# Altium project SDP_V2.0.PrjPcb
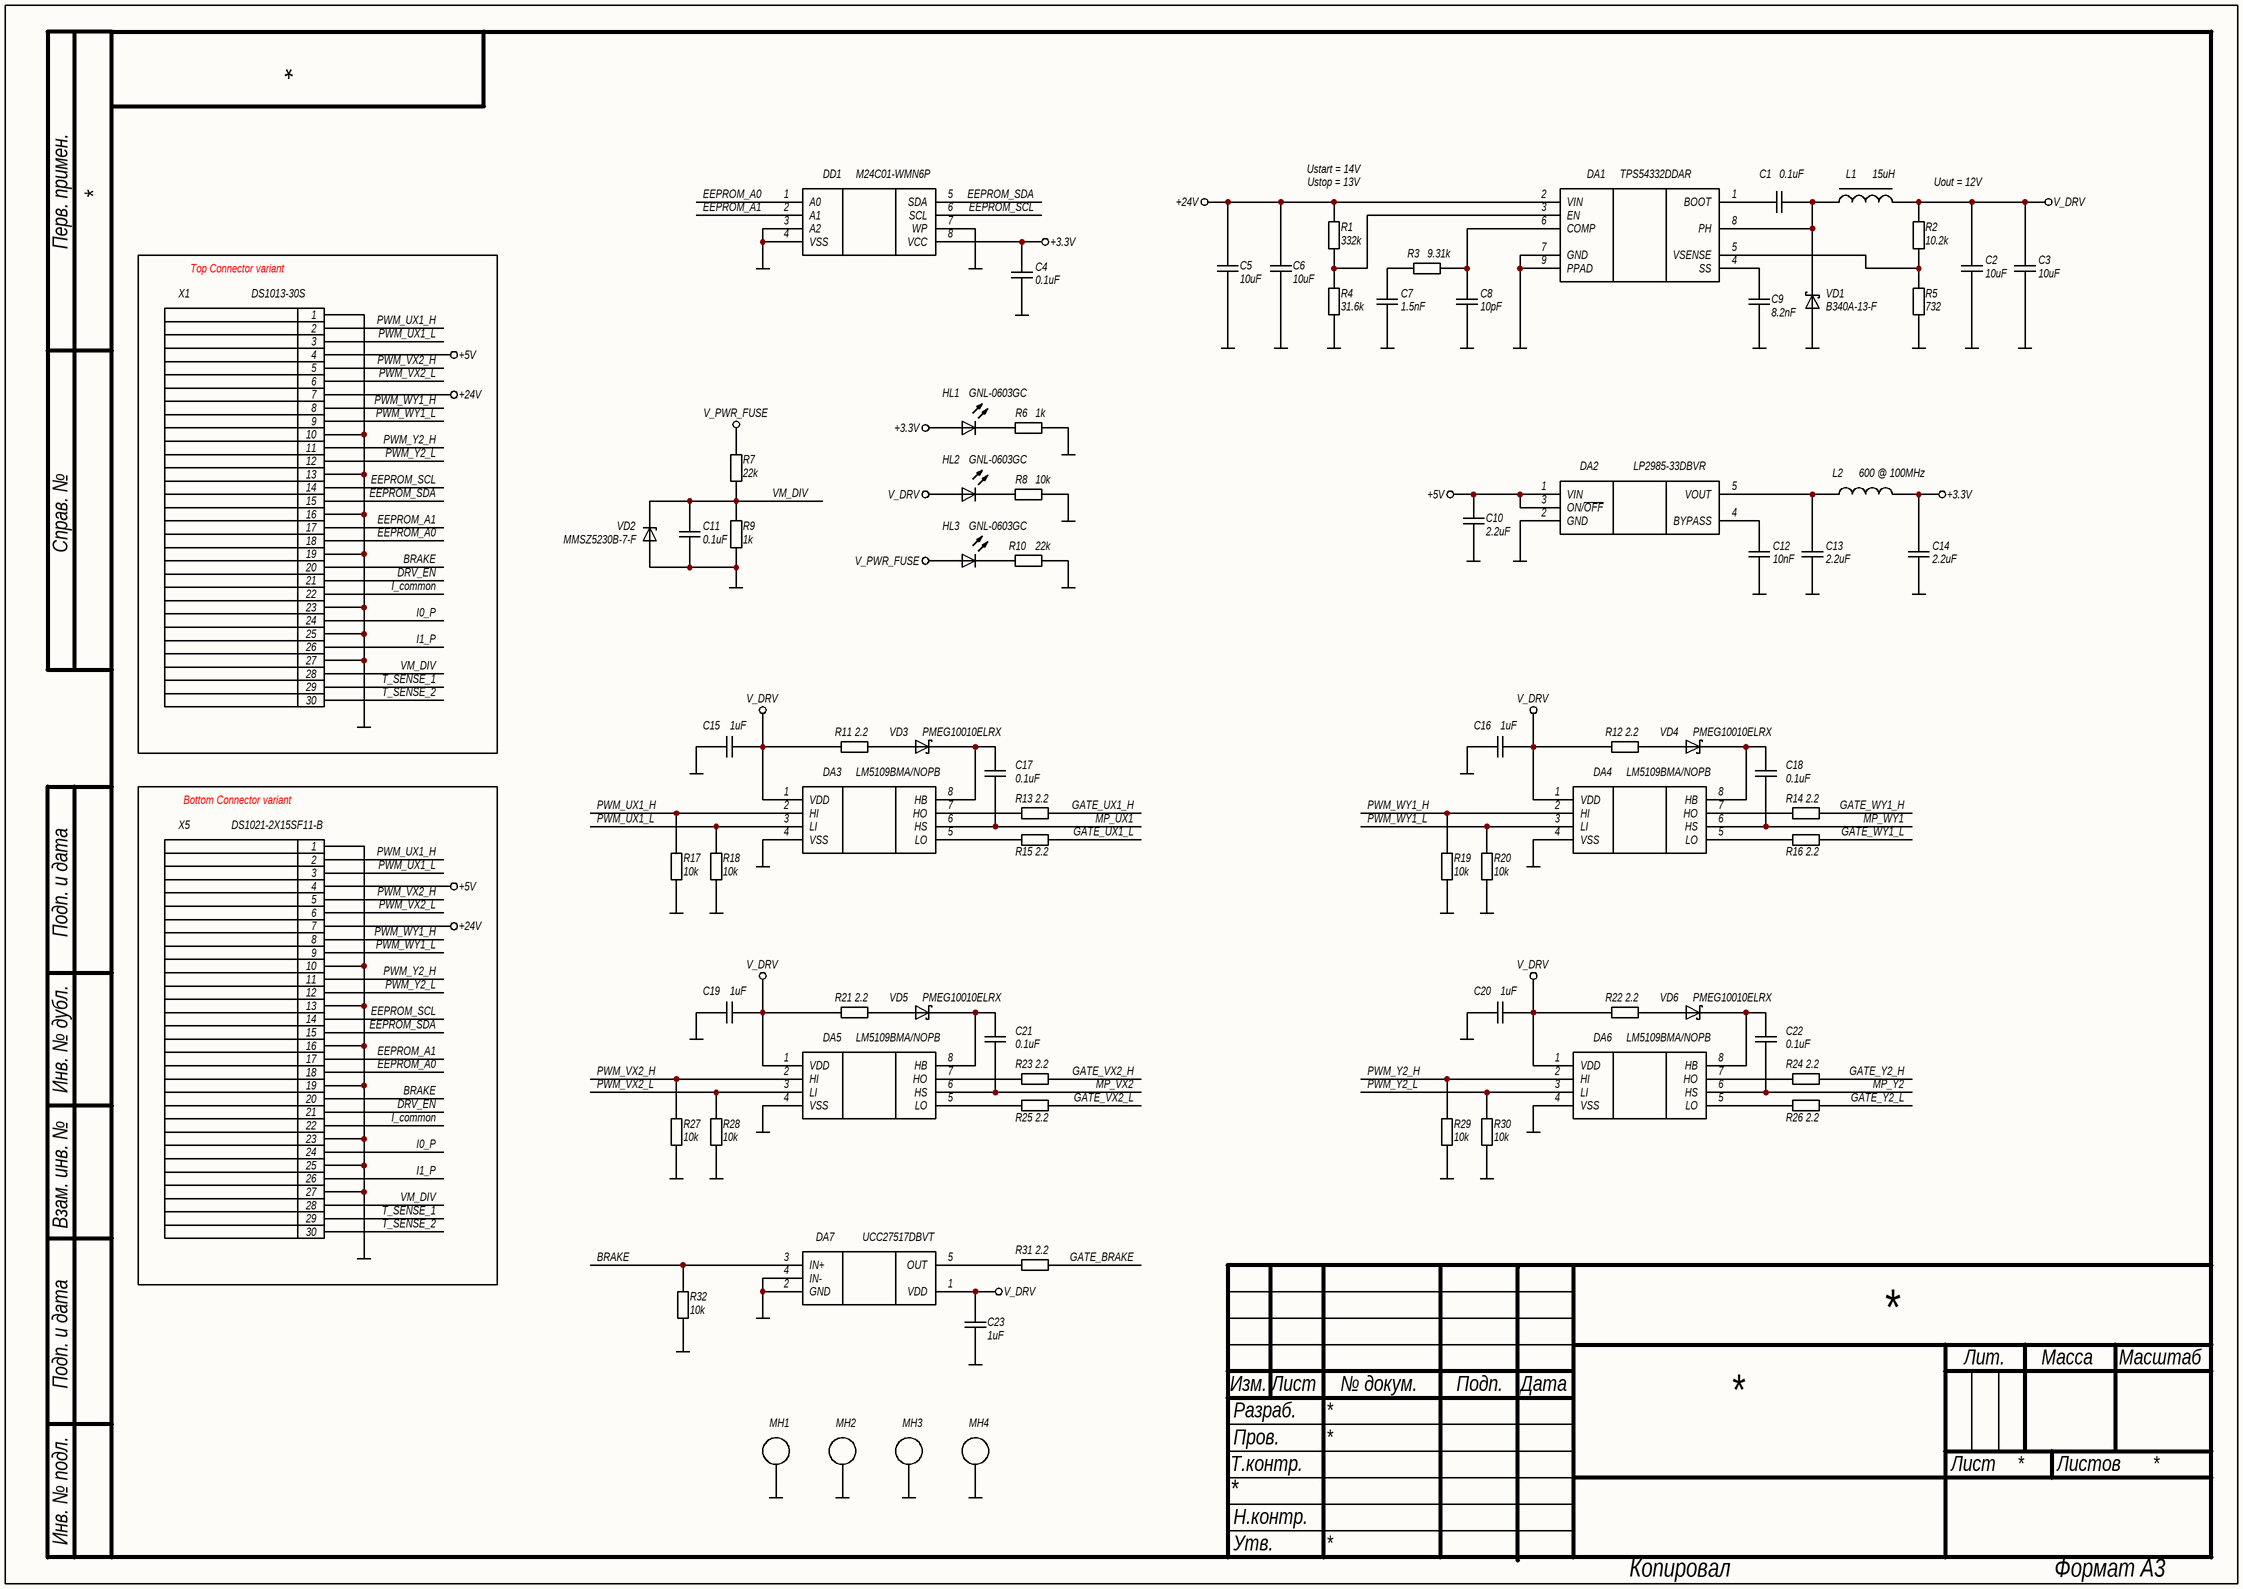
[diagram p0: DRIVERS.SchDoc]
2 sheets, 154 parts. Net scope: global (net labels, ports and power ports of the same name join across sheets).
Board file: SDP_V2.0.PcbDoc
Sheets:
  DRIVERS.SchDoc
  MOSFETS.SchDoc

## Sheet DRIVERS.SchDoc
size 420 x 297 mm; PageSetup: Record=PageOptions|CenterHorizontal=False|CenterVertical=False|PrintScale=0.95|XCorrection=0.00|YCorrection=0.00|PrintKind=1|BorderSize=5000000|LeftOffset=0|BottomOffset=0|Orientation=1|PaperLength=1000|PaperWidth=1000|Scale=100|PaperSource=15|PrintQuality=600|MediaType=1|DitherType=10|PaperKind=A4|PrintScaleMode=1

### Parts
C1  0.1uF  [C0603N]
C2  10uF  [C0805N]
C3  10uF  [C0805N]
C4  0.1uF  [C0603N]
C5  10uF  [C1206N]
C6  10uF  [C1206N]
C7  1.5nF  [C0603N]
C8  10pF  [C0603N]
C9  8.2nF  [C0603N]
C10  2.2uF  [C0603N]
C11  0.1uF  [C0603N]
C12  10nF  [C0603N]
C13  2.2uF  [C0603N]
C14  2.2uF  [C0603N]
C15  1uF  [C0805N]
C16  1uF  [C0805N]
C17  0.1uF  [C0603N]
C18  0.1uF  [C0603N]
C19  1uF  [C0805N]
C20  1uF  [C0805N]
C21  0.1uF  [C0603N]
C22  0.1uF  [C0603N]
C23  1uF  [C0805N]
DA1  TPS54332DDAR  [SOIC8-EP]
DA2  LP2985-33DBVR  [DBV0005A (SOT23-5)]
DA3  LM5109BMA/NOPB  [D0008A]
DA4  LM5109BMA/NOPB  [D0008A]
DA5  LM5109BMA/NOPB  [D0008A]
DA6  LM5109BMA/NOPB  [D0008A]
DA7  UCC27517DBVT  [DBV0005A (SOT23-5)]
DD1  M24C01-WMN6P  [SOIC8]
HL1  GNL-0603GC  [LED0603]
HL2  GNL-0603GC  [LED0603]
HL3  GNL-0603GC  [LED0603]
L1  15uH  [SRN8040]
L2  600 @ 100MHz  [FB0603N]
MH1  MNT_HOLE_PL  [MH_3.2_5.4_PLATED_VIA]  (value not drawn)  (no BOM)
MH2  MNT_HOLE_PL  [MH_3.2_5.4_PLATED_VIA]  (value not drawn)  (no BOM)
MH3  MNT_HOLE_PL  [MH_3.2_5.4_PLATED_VIA]  (value not drawn)  (no BOM)
MH4  MNT_HOLE_PL  [MH_3.2_5.4_PLATED_VIA]  (value not drawn)  (no BOM)
R1  332k  [R0603N]
R2  10.2k  [R0603N]
R3  9.31k  [R0603N]
R4  31.6k  [R0603N]
R5  732  [R0603N]
R6  1k  [R0603N]
R7  22k  [R0603N]
R8  10k  [R0603N]
R9  1k  [R0603N]
R10  22k  [R0603N]
R11  2.2  [R0603N]
R12  2.2  [R0603N]
R13  2.2  [R0603N]
R14  2.2  [R0603N]
R15  2.2  [R0603N]
R16  2.2  [R0603N]
R17  10k  [R0603N]
R18  10k  [R0603N]
R19  10k  [R0603N]
R20  10k  [R0603N]
R21  2.2  [R0603N]
R22  2.2  [R0603N]
R23  2.2  [R0603N]
R24  2.2  [R0603N]
R25  2.2  [R0603N]
R26  2.2  [R0603N]
R27  10k  [R0603N]
R28  10k  [R0603N]
R29  10k  [R0603N]
R30  10k  [R0603N]
R31  2.2  [R0603N]
R32  10k  [R0603N]
VD1  B340A-13-F  [SMA]
VD2  MMSZ5230B-7-F  [SOD123]
VD3  PMEG10010ELRX  [SOD123W]
VD4  PMEG10010ELRX  [SOD123W]
VD5  PMEG10010ELRX  [SOD123W]
VD6  PMEG10010ELRX  [SOD123W]
X1  DS1013-30S  [2.54_2X15_HEADER_BOX]
X5  DS1021-2X15SF11-B  [2.54_2X15_HEADER]

### Blocks framed on the sheet
Top Connector variant: X1
Bottom Connector variant: X5

### Nets
+3.3V: C4.2 C14.2 DD1.8(VCC) HL1.2(A) L2.2
+5V: C10.2 DA2.1(VIN) DA2.3(ON/~{OFF}) X1.4 X5.4
+24V: C5.2 C6.2 DA1.2(VIN) R1.1 X1.7 X5.7
GND: C2.2 C3.1 C4.1 C5.1 C6.1 C7.1 C8.1 C9.1 C10.1 C11.1 C12.1 C13.1 C14.1 C15.2 C16.2 C19.2 C20.2 C23.2 DA1.7(GND) DA1.9(PPAD) DA2.2(GND) DA3.4(VSS) DA4.4(VSS) DA5.4(VSS) DA6.4(VSS) DA7.2(GND) DA7.4(IN-) DD1.3(A2) DD1.4(VSS) DD1.7(WP) MH1.1 MH2.1 MH3.1 MH4.1 R4.2 R5.2 R6.2 R8.2 R9.2 R10.2 R17.2 R18.2 R19.2 R20.2 R27.2 R28.2 R29.2 R30.2 R32.2 VD1.2(A) VD2.2(A) X1.1 X1.10 X1.13 X1.16 X1.19 X1.23 X1.25 X1.27 X5.1 X5.10 X5.13 X5.16 X5.19 X5.23 X5.25 X5.27
V_DRV: C2.1 C3.2 C15.1 C16.1 C19.1 C20.1 C23.1 DA3.1(VDD) DA4.1(VDD) DA5.1(VDD) DA6.1(VDD) DA7.1(VDD) HL2.2(A) L1.2 R2.1 R11.2 R12.2 R21.2 R22.2
V_PWR_FUSE: HL3.2(A) R7.1
BRAKE: DA7.3(IN+) R32.1 X1.20 X5.20
DRV_EN: X1.21 X5.21
EEPROM_A0: DD1.1(A0) X1.18 X5.18
EEPROM_A1: DD1.2(A1) X1.17 X5.17
EEPROM_SCL: DD1.6(SCL) X1.14 X5.14
EEPROM_SDA: DD1.5(SDA) X1.15 X5.15
GATE_BRAKE: R31.1
GATE_UX1_H: R13.1
GATE_UX1_L: R15.1
GATE_VX2_H: R23.1
GATE_VX2_L: R25.1
GATE_WY1_H: R14.1
GATE_WY1_L: R16.1
GATE_Y2_H: R24.1
GATE_Y2_L: R26.1
I0_P: X1.24 X5.24
I1_P: X1.26 X5.26
I_common: X1.22 X5.22
MP_UX1: C17.2 DA3.6(HS)
MP_VX2: C21.2 DA5.6(HS)
MP_WY1: C18.2 DA4.6(HS)
MP_Y2: C22.2 DA6.6(HS)
PWM_UX1_H: DA3.2(HI) R17.1 X1.2 X5.2
PWM_UX1_L: DA3.3(LI) R18.1 X1.3 X5.3
PWM_VX2_H: DA5.2(HI) R27.1 X1.5 X5.5
PWM_VX2_L: DA5.3(LI) R28.1 X1.6 X5.6
PWM_WY1_H: DA4.2(HI) R19.1 X1.8 X5.8
PWM_WY1_L: DA4.3(LI) R20.1 X1.9 X5.9
PWM_Y2_H: DA6.2(HI) R29.1 X1.11 X5.11
PWM_Y2_L: DA6.3(LI) R30.1 X1.12 X5.12
T_SENSE_1: X1.29 X5.29
T_SENSE_2: X1.30 X5.30
VM_DIV: C11.2 R7.2 R9.1 VD2.1(K) X1.28 X5.28
NetC1_1: C1.1 DA1.1(BOOT)
NetC1_2: C1.2 DA1.8(PH) L1.1 VD1.1(K)
NetC7_2: C7.2 R3.2
NetC8_2: C8.2 DA1.6(COMP) R3.1
NetC9_2: C9.2 DA1.4(SS)
NetC12_2: C12.2 DA2.4(BYPASS)
NetC13_2: C13.2 DA2.5(VOUT) L2.1
NetC17_1: C17.1 DA3.8(HB) VD3.1(K)
NetC18_1: C18.1 DA4.8(HB) VD4.1(K)
NetC21_1: C21.1 DA5.8(HB) VD5.1(K)
NetC22_1: C22.1 DA6.8(HB) VD6.1(K)
NetDA1_3: DA1.3(EN) R1.2 R4.1
NetDA1_5: DA1.5(VSENSE) R2.2 R5.1
NetDA3_5: DA3.5(LO) R15.2
NetDA3_7: DA3.7(HO) R13.2
NetDA4_5: DA4.5(LO) R16.2
NetDA4_7: DA4.7(HO) R14.2
NetDA5_5: DA5.5(LO) R25.2
NetDA5_7: DA5.7(HO) R23.2
NetDA6_5: DA6.5(LO) R26.2
NetDA6_7: DA6.7(HO) R24.2
NetDA7_5: DA7.5(OUT) R31.2
NetHL1_1: HL1.1(K) R6.1
NetHL2_1: HL2.1(K) R8.1
NetHL3_1: HL3.1(K) R10.1
NetR11_1: R11.1 VD3.2(A)
NetR12_1: R12.1 VD4.2(A)
NetR21_1: R21.1 VD5.2(A)
NetR22_1: R22.1 VD6.2(A)

### Notes on the sheet
- (near R1) Ustart = 14V
- (near R1) Ustop = 13V
- Uout = 12V
- Перв. примен.
- Справ. №
- Подп. и дата
- Инв. № дубл.
- Взам. инв. №
- Изм.
- Лист
- № докум.
- Подп.
- Дата
- Лит.
- Масса
- Масштаб
- Т.контр.
- Пров.
- Разраб.
- Листов
- Инв. № подл.
- Н.контр.
- Утв.
- Копировал
- Формат А3

### Library data of the parts
C1 C4 C11 C17 C18 C21 C22 = CL10B104KB8NNNC: Конденсатор; Точность: 10%; Напряжение: 50V; Диэлектрик: X7R; Производитель: Samsung Electro-Mechanics; Описание: 0.1 µF ±10% 50V Ceramic Capacitor X7R 0603 (1608 Metric); Корпус: 0603 (1608 Metric); Температурный диапазон: -55°C ~ 125°C; Вид монтажа: SMD; Артикул: CL10B104KB8NNNC; Номинал: 0.1uF; Строка для документации: https://mm.digikey.com/Volume0/opasdata/d220001/medias/docus/609/CL10B104KB8NNNC_Spec.pdf; Тип элемента: Конденсатор
C2 C3 = CL21A106KAYNNNE: Конденсатор; Точность: 10%; Напряжение: 25V; Диэлектрик: X5R; Производитель: Samsung Electro-Mechanics; Описание: 10 µF ±10% 25V Ceramic Capacitor X5R 0805 (2012 Metric); Корпус: 0805 (2012 Metric); Температурный диапазон: -55°C ~ 85°C; Вид монтажа: SMD; Артикул: CL21A106KAYNNNE; Номинал: 10uF; Строка для документации: https://mm.digikey.com/Volume0/opasdata/d220001/medias/docus/5545/CL21A106KAYNNNE%20Spec.pdf; Тип элемента: Конденсатор
C5 C6 = CL31B106KBHNNNE: Конденсатор; Точность: 10%; Напряжение: 50V; Диэлектрик: X7R; Производитель: Samsung Electro-Mechanics; Описание: 10 µF ±10% 50V Ceramic Capacitor X7R 1206 (3216 Metric); Корпус: 1206 (3216 Metric); Температурный диапазон: -55°C ~ 125°C; Вид монтажа: SMD; Артикул: CL31B106KBHNNNE; Номинал: 10uF; Строка для документации: https://mm.digikey.com/Volume0/opasdata/d220001/medias/docus/41/CL31B106KBHNNNE_Spec.pdf; Тип элемента: Конденсатор
C7 = CL10B152KB8WPNC: Конденсатор; Точность: 10%; Напряжение: 50V; Диэлектрик: X7R; Производитель: Samsung Electro-Mechanics; Описание: 1500 pF ±10% 50V Ceramic Capacitor X7R 0603 (1608 Metric); Корпус: 0603 (1608 Metric); Температурный диапазон: -55°C ~ 125°C; Вид монтажа: SMD; Артикул: CL10B152KB8WPNC; Номинал: 1.5nF; Строка для документации: https://mm.digikey.com/Volume0/opasdata/d220001/medias/docus/41/CL10B152KB8WPNC_Spec.pdf; Тип элемента: Конденсатор
C8 = CL10C100CB8NNNC: Конденсатор; Точность: ±0.25pF; Напряжение: 50V; Диэлектрик: NP0; Производитель: Samsung Electro-Mechanics; Описание: 10 pF ±0.25pF 50V Ceramic Capacitor C0G, NP0 0603 (1608 Metric); Корпус: 0603 (1608 Metric); Температурный диапазон: -55°C ~ 125°C; Вид монтажа: SMD; Артикул: CL10C100CB8NNNC; Номинал: 10pF; Строка для документации: https://www.samsungsem.com/resources/file/global/support/product_catalog/MLCC.pdf; Тип элемента: Конденсатор
C9 = CC0603KRX7R9BB822: Конденсатор; Точность: 10%; Напряжение: 50V; Диэлектрик: X7R; Производитель: YAGEO; Описание: 8200 pF ±10% 50V Ceramic Capacitor X7R 0603 (1608 Metric); Корпус: 0603 (1608 Metric); Температурный диапазон: -55°C ~ 125°C; Вид монтажа: SMD; Артикул: CC0603KRX7R9BB822; Номинал: 8.2nF; Строка для документации: https://www.yageo.com/upload/media/product/productsearch/datasheet/mlcc/UPY-GPHC_X7R_6.3V-to-250V_23.pdf; Тип элемента: Конденсатор
C10 C13 C14 = CL10A225KO8NNNC: Конденсатор; Точность: 10%; Напряжение: 16V; Диэлектрик: X5R; Производитель: Samsung Electro-Mechanics; Описание: 2.2 µF ±10% 16V Ceramic Capacitor X5R 0603 (1608 Metric); Корпус: 0603 (1608 Metric); Температурный диапазон: -55°C ~ 85°C; Вид монтажа: SMD; Артикул: CL10A225KO8NNNC; Номинал: 2.2uF; Строка для документации: https://mm.digikey.com/Volume0/opasdata/d220001/medias/docus/421/CL10A225KO8NNNC_Spec.pdf; Тип элемента: Конденсатор
C12 = CL10B103KB8NNNC: Конденсатор; Точность: 10%; Напряжение: 16V; Диэлектрик: X7R; Производитель: Samsung Electro-Mechanics; Описание: 10000 pF ±10% 50V Ceramic Capacitor X7R 0603 (1608 Metric); Корпус: 0603 (1608 Metric); Температурный диапазон: -55°C ~ 125°C; Вид монтажа: SMD; Артикул: CL10B103KB8NNNC; Номинал: 10nF; Строка для документации: https://mm.digikey.com/Volume0/opasdata/d220001/medias/docus/609/CL10B103KB8NNNC_Spec.pdf; Тип элемента: Конденсатор
C15 C16 C19 C20 C23 = CL21B105KAFNNNE: Конденсатор; Точность: 10%; Напряжение: 25V; Диэлектрик: X7R; Производитель: Samsung Electro-Mechanics; Описание: 1 µF ±10% 25V Ceramic Capacitor X7R 0805 (2012 Metric); Корпус: 0805 (2012 Metric); Вид монтажа: SMD; Артикул: CL21B105KAFNNNE; Номинал: 1uF; Строка для документации: https://mm.digikey.com/Volume0/opasdata/d220001/medias/docus/1105/CL21B105KAFNNNE_Spec.pdf; Тип элемента: Конденсатор
DA1 = TPS54332DDAR: Микросхема понижающего преобразователя; Производитель: Texas Instruments; Описание: Buck Switching Regulator IC Positive Adjustable 0.8V 1 Output 3.5A 8-PowerSOIC (0.154", 3.90mm Width); Корпус: 8-PowerSOIC (0.154", 3.90mm Width); Температурный диапазон: -40°C ~ 150°C (TJ); Вид монтажа: SMD; Артикул: TPS54332DDAR; Строка для документации: https://www.ti.com/lit/ds/symlink/tps54332.pdf; Тип элемента: Микросхема
DA2 = LP2985-33DBVR: Микросхема стабилизатор напряжения положительной полярности; Производитель: Texas Instruments; Описание: Linear Voltage Regulator IC Positive Fixed 1 Output 150mA SOT-23-5; Корпус: SOT-23-5; Температурный диапазон: -40°C ~ 125°C; Вид монтажа: SMD; Артикул: LP2985-33DBVR; Строка для документации: https://www.ti.com/lit/ds/symlink/lp2985.pdf; Тип элемента: Микросхема
DA3-DA6 = LM5109BMA/NOPB: Микросхема драйвер затворов нижнего и верхнего ключа; Производитель: Texas Instruments; Описание: Half-Bridge Gate Driver IC Non-Inverting 8-SOIC; Корпус: 8-SOIC (0.154", 3.90mm Width); Температурный диапазон: -40°C ~ 125°C (TJ); Вид монтажа: SMD; Артикул: LM5109BMA/NOPB; Строка для документации: https://www.ti.com/lit/ds/symlink/lm5109b.pdf; Тип элемента: Микросхема
DA7 = UCC27517DBVT: Микросхема драйвер затвора нижнего ключа; Производитель: Texas Instruments; Описание: Low-Side Gate Driver IC Inverting, Non-Inverting SOT-23-5; Корпус: SOT-23-5; Температурный диапазон: -40°C ~ 140°C (TJ); Вид монтажа: SMD; Артикул: UCC27517DBVT; Строка для документации: https://www.ti.com/lit/ds/symlink/ucc27517.pdf; Тип элемента: Микросхема
DD1 = M24C01-WMN6P: Микросхема EEPROM с I2C интерфейсом; Производитель: STMicroelectronics; Описание: EEPROM Memory IC 1Kbit I2C 400 kHz 900 ns 8-SOIC; Корпус: 8-SOIC (0.154", 3.90mm Width); Температурный диапазон: -40°C ~ 85°C (TA); Вид монтажа: SMD; Артикул: M24C01-WMN6P; Строка для документации: https://www.st.com/content/ccc/resource/technical/document/datasheet/b0/d8/50/40/5a/85/49/6f/DM00071904.pdf/files/DM00071904.pdf/jcr:content/translations/en.DM00071904.pdf; Тип элемента: Микросхема
HL1-HL3 = GNL-0603GC: Светодиод; Прямой ток: 20mA; Напряжение: 2V; Цвет: Зеленый; Длина волны: 567nm; Производитель: G-nor Electronics; Описание: Green 567nm LED Indication - Discrete 2V 0603 (1608 Metric); Корпус: 0603 (1608 Metric); Температурный диапазон: -40°C ~ 80°C; Вид монтажа: SMD; Тип элемента: Диод; Артикул: GNL-0603GC; Яркость: LED; Строка для документации: https://www.g-nor.com/Uploads/Ed/file/20210517/1621223120713818.doc
L1 = SRN8040-150M: Дроссель с магнитопроводом; Точность: 20%; Ток номинальный: 2.4A; Ток насыщения: 2.7A; Сопротивление: 70m; Производитель: Bourns Inc.; Описание: 15 µH Semi-Shielded Drum Core, Wirewound Inductor 2.4 A 70mOhm Max Nonstandard; Корпус: 8.00mm x 8.00mm; Температурный диапазон: -40°C ~ 125°C; Вид монтажа: SMD; Артикул: SRN8040-150M; Номинал: 15uH; Строка для документации: https://www.bourns.com/docs/Product-Datasheets/SRN8040.pdf; Тип элемента: Дроссель
L2 = BLM18AG601SN1D: Фильтр ЭМП индуктивный; Ток: 500mA; Сопротивление: 380m; Тип: Ferrite Bead; Производитель: Murata Electronics; Описание: 600 Ohms @ 100 MHz 1 Ferrite Bead 0603 (1608 Metric) 500mA 380mOhm; Корпус: 0603 (1608 Metric); Температурный диапазон: -55°C ~ 125°C; Вид монтажа: SMD; Артикул: BLM18AG601SN1D; Номинал: 600 @ 100MHz; Строка для документации: https://www.murata.com/en-us/products/productdata/8796738650142/ENFA0003.pdf; Тип элемента: Фильтр ЭМП
MH1-MH4 = Mounting Hole, 3.2mm/5.4mm, plated, with via stiching: Монтажное отверстие, металлизированное; Тип элемента: Механический; Артикул: Mounting Hole, 3.2mm/5.4mm, plated, with via stiching; Описание: Mounting Hole, 3.2mm/5.4mm , plated, with via stiching; Тип: Mounting Hole
R1 = RC0603FR-07332KL: Резистор; Точность: 1%; ТКС: ±100ppm/°C; Напряжение: 75V; Производитель: YAGEO; Описание: 332 kOhms ±1% 0.1W, 1/10W Chip Resistor 0603 (1608 Metric) Moisture Resistant Thick Film; Корпус: 0603 (1608 Metric); Температурный диапазон: -55°C ~ 155°C; Вид монтажа: SMD; Артикул: RC0603FR-07332KL; Номинал: 332k; Строка для документации: https://www.yageo.com/upload/media/product/app/datasheet/rchip/pyu-rc_group_51_rohs_l.pdf; Тип элемента: Резистор
R2 = RC0603FR-0710K2L: Резистор; Точность: 1%; ТКС: ±100ppm/°C; Напряжение: 75V; Производитель: YAGEO; Описание: 10.2 kOhms ±1% 0.1W, 1/10W Chip Resistor 0603 (1608 Metric) Moisture Resistant Thick Film; Корпус: 0603 (1608 Metric); Температурный диапазон: -55°C ~ 155°C; Вид монтажа: SMD; Артикул: RC0603FR-0710K2L; Номинал: 10.2k; Строка для документации: https://www.yageo.com/upload/media/product/app/datasheet/rchip/pyu-rc_group_51_rohs_l.pdf; Тип элемента: Резистор
R3 = RC0603FR-079K31L: Резистор; Точность: 1%; ТКС: ±100ppm/°C; Напряжение: 75V; Производитель: YAGEO; Описание: 9.31 kOhms ±1% 0.1W, 1/10W Chip Resistor 0603 (1608 Metric) Moisture Resistant Thick Film; Корпус: 0603 (1608 Metric); Температурный диапазон: -55°C ~ 155°C; Вид монтажа: SMD; Артикул: RC0603FR-079K31L; Номинал: 9.31k; Строка для документации: https://www.yageo.com/upload/media/product/app/datasheet/rchip/pyu-rc_group_51_rohs_l.pdf; Тип элемента: Резистор
R4 = RC0603FR-0731K6L: Резистор; Точность: 1%; ТКС: ±100ppm/°C; Напряжение: 75V; Производитель: YAGEO; Описание: 31.6 kOhms ±1% 0.1W, 1/10W Chip Resistor 0603 (1608 Metric) Moisture Resistant Thick Film; Корпус: 0603 (1608 Metric); Температурный диапазон: -55°C ~ 155°C; Вид монтажа: SMD; Артикул: RC0603FR-0731K6L; Номинал: 31.6k; Строка для документации: https://www.yageo.com/upload/media/product/app/datasheet/rchip/pyu-rc_group_51_rohs_l.pdf; Тип элемента: Резистор
R5 = RC0603FR-07732RL: Резистор; Точность: 1%; ТКС: ±100ppm/°C; Напряжение: 75V; Производитель: YAGEO; Описание: 732 kOhms ±1% 0.1W, 1/10W Chip Resistor 0603 (1608 Metric) Moisture Resistant Thick Film; Корпус: 0603 (1608 Metric); Температурный диапазон: -55°C ~ 155°C; Вид монтажа: SMD; Артикул: RC0603FR-07732RL; Номинал: 732; Строка для документации: https://www.yageo.com/upload/media/product/app/datasheet/rchip/pyu-rc_group_51_rohs_l.pdf; Тип элемента: Резистор
R6 R9 = RC0603FR-071KL: Резистор; Точность: 1%; ТКС: ±100ppm/°C; Напряжение: 75V; Производитель: YAGEO; Описание: 1 kOhms ±1% 0.1W, 1/10W Chip Resistor 0603 (1608 Metric) Moisture Resistant Thick Film; Корпус: 0603 (1608 Metric); Температурный диапазон: -55°C ~ 155°C; Вид монтажа: SMD; Артикул: RC0603FR-071KL; Номинал: 1k; Строка для документации: https://www.yageo.com/upload/media/product/app/datasheet/rchip/pyu-rc_group_51_rohs_l.pdf; Тип элемента: Резистор
R7 R10 = RC0603FR-0722KL: Резистор; Точность: 1%; ТКС: ±100ppm/°C; Напряжение: 75V; Производитель: YAGEO; Описание: 22 kOhms ±1% 0.1W, 1/10W Chip Resistor 0603 (1608 Metric) Moisture Resistant Thick Film; Корпус: 0603 (1608 Metric); Температурный диапазон: -55°C ~ 155°C; Вид монтажа: SMD; Артикул: RC0603FR-0722KL; Номинал: 22k; Строка для документации: https://www.yageo.com/upload/media/product/app/datasheet/rchip/pyu-rc_group_51_rohs_l.pdf; Тип элемента: Резистор
R8 R17-R20 R27-R30 R32 = RC0603FR-0710KL: Резистор; Точность: 1%; ТКС: ±100ppm/°C; Напряжение: 75V; Производитель: YAGEO; Описание: 10 kOhms ±1% 0.1W, 1/10W Chip Resistor 0603 (1608 Metric) Moisture Resistant Thick Film; Корпус: 0603 (1608 Metric); Температурный диапазон: -55°C ~ 155°C; Вид монтажа: SMD; Артикул: RC0603FR-0710KL; Номинал: 10k; Строка для документации: https://www.yageo.com/upload/media/product/app/datasheet/rchip/pyu-rc_group_51_rohs_l.pdf; Тип элемента: Резистор
R11-R16 R21-R26 R31 = RC0603FR-072R2L: Резистор; Точность: 1%; ТКС: ±100ppm/°C; Напряжение: 75V; Производитель: YAGEO; Описание: 2.2 Ohms ±1% 0.1W, 1/10W Chip Resistor 0603 (1608 Metric) Moisture Resistant Thick Film; Корпус: 0603 (1608 Metric); Температурный диапазон: -55°C ~ 155°C; Вид монтажа: SMD; Артикул: RC0603FR-072R2L; Номинал: 2.2; Строка для документации: https://www.yageo.com/upload/media/product/app/datasheet/rchip/pyu-rc_group_51_rohs_l.pdf; Тип элемента: Резистор
VD1 = B340A-13-F: Диод Шоттки; Прямой ток: 3A; Напряжение: 40V; Производитель: Diodes Incorporated; Описание: Diode 40 V 3A Surface Mount SMA; Корпус: DO-214AC, SMA; Температурный диапазон: -55°C ~ 150°C; Вид монтажа: SMD; Артикул: B340A-13-F; Тип: Schottky; Строка для документации: https://www.diodes.com/assets/Datasheets/ds30891.pdf; Тип элемента: Диод
VD2 = MMSZ5230B-7-F: Стабилитрон; Прямой ток: 20mA; Напряжение: 4.7V; Производитель: Diodes Incorporated; Описание: Zener Diode 4.7 V 500 mW ±5% Surface Mount SOD-123; Корпус: SOD-123; Температурный диапазон: -65°C ~ 150°C; Вид монтажа: SMD; Тип элемента: Диод; Артикул: MMSZ5230B-7-F; Тип: Zener; Строка для документации: https://www.diodes.com/assets/Datasheets/ds18010.pdf
VD3-VD6 = PMEG10010ELRX: Диод Шоттки; Прямой ток: 1A; Напряжение: 100V; Производитель: Nexperia USA Inc.; Описание: Diode 100 V 1A Surface Mount SOD-123W; Корпус: SOD-123W; Температурный диапазон: -40°C ~ 175°C; Вид монтажа: SMD; Артикул: PMEG10010ELRX; Тип: Schottky; Строка для документации: https://assets.nexperia.com/documents/data-sheet/PMEG10010ELR.pdf; Тип элемента: Диод
X1 = DS1013-30S: Разъем, 30 контактов; Тип разъема: Header, Male Pin; Количество контактов: 30; Шаг контактов: 2.54mm; Ток: 3A; Напряжение: 250V; Производитель: Connfly electronic (Zhenqin); Описание: Connector Header Through Hole 30 position 0.100" (2.54mm); Температурный диапазон: -40°C ~ 105°C; Вид монтажа: Through Hole; Артикул: DS1013-30S; Строка для документации: http://cn.connfly.group/static/upload/file/pdf/DS1013.pdf; Тип элемента: Разъем
X5 = DS1021-2X15SF11-B: Разъем, 30 контактов; Тип разъема: Header, Male Pin; Количество контактов: 30; Шаг контактов: 2.54mm; Ток: 3A; Напряжение: 250V; Производитель: Connfly electronic (Zhenqin); Описание: Connector Header Through Hole 30 position 0.100" (2.54mm); Температурный диапазон: -40°C ~ 105°C; Вид монтажа: Through Hole; Артикул: DS1021-2X15SF11-B; Строка для документации: http://cn.connfly.group/static/upload/file/pdf/DS1021.pdf; Тип элемента: Разъем

## Sheet MOSFETS.SchDoc
size 420 x 297 mm; PageSetup: Record=PageOptions|CenterHorizontal=False|CenterVertical=False|PrintScale=0.95|XCorrection=0.00|YCorrection=0.00|PrintKind=1|BorderSize=5000000|LeftOffset=0|BottomOffset=0|Orientation=1|PaperLength=1000|PaperWidth=1000|Scale=100|PaperSource=15|PrintQuality=600|MediaType=1|DitherType=10|PaperKind=A4|PrintScaleMode=1
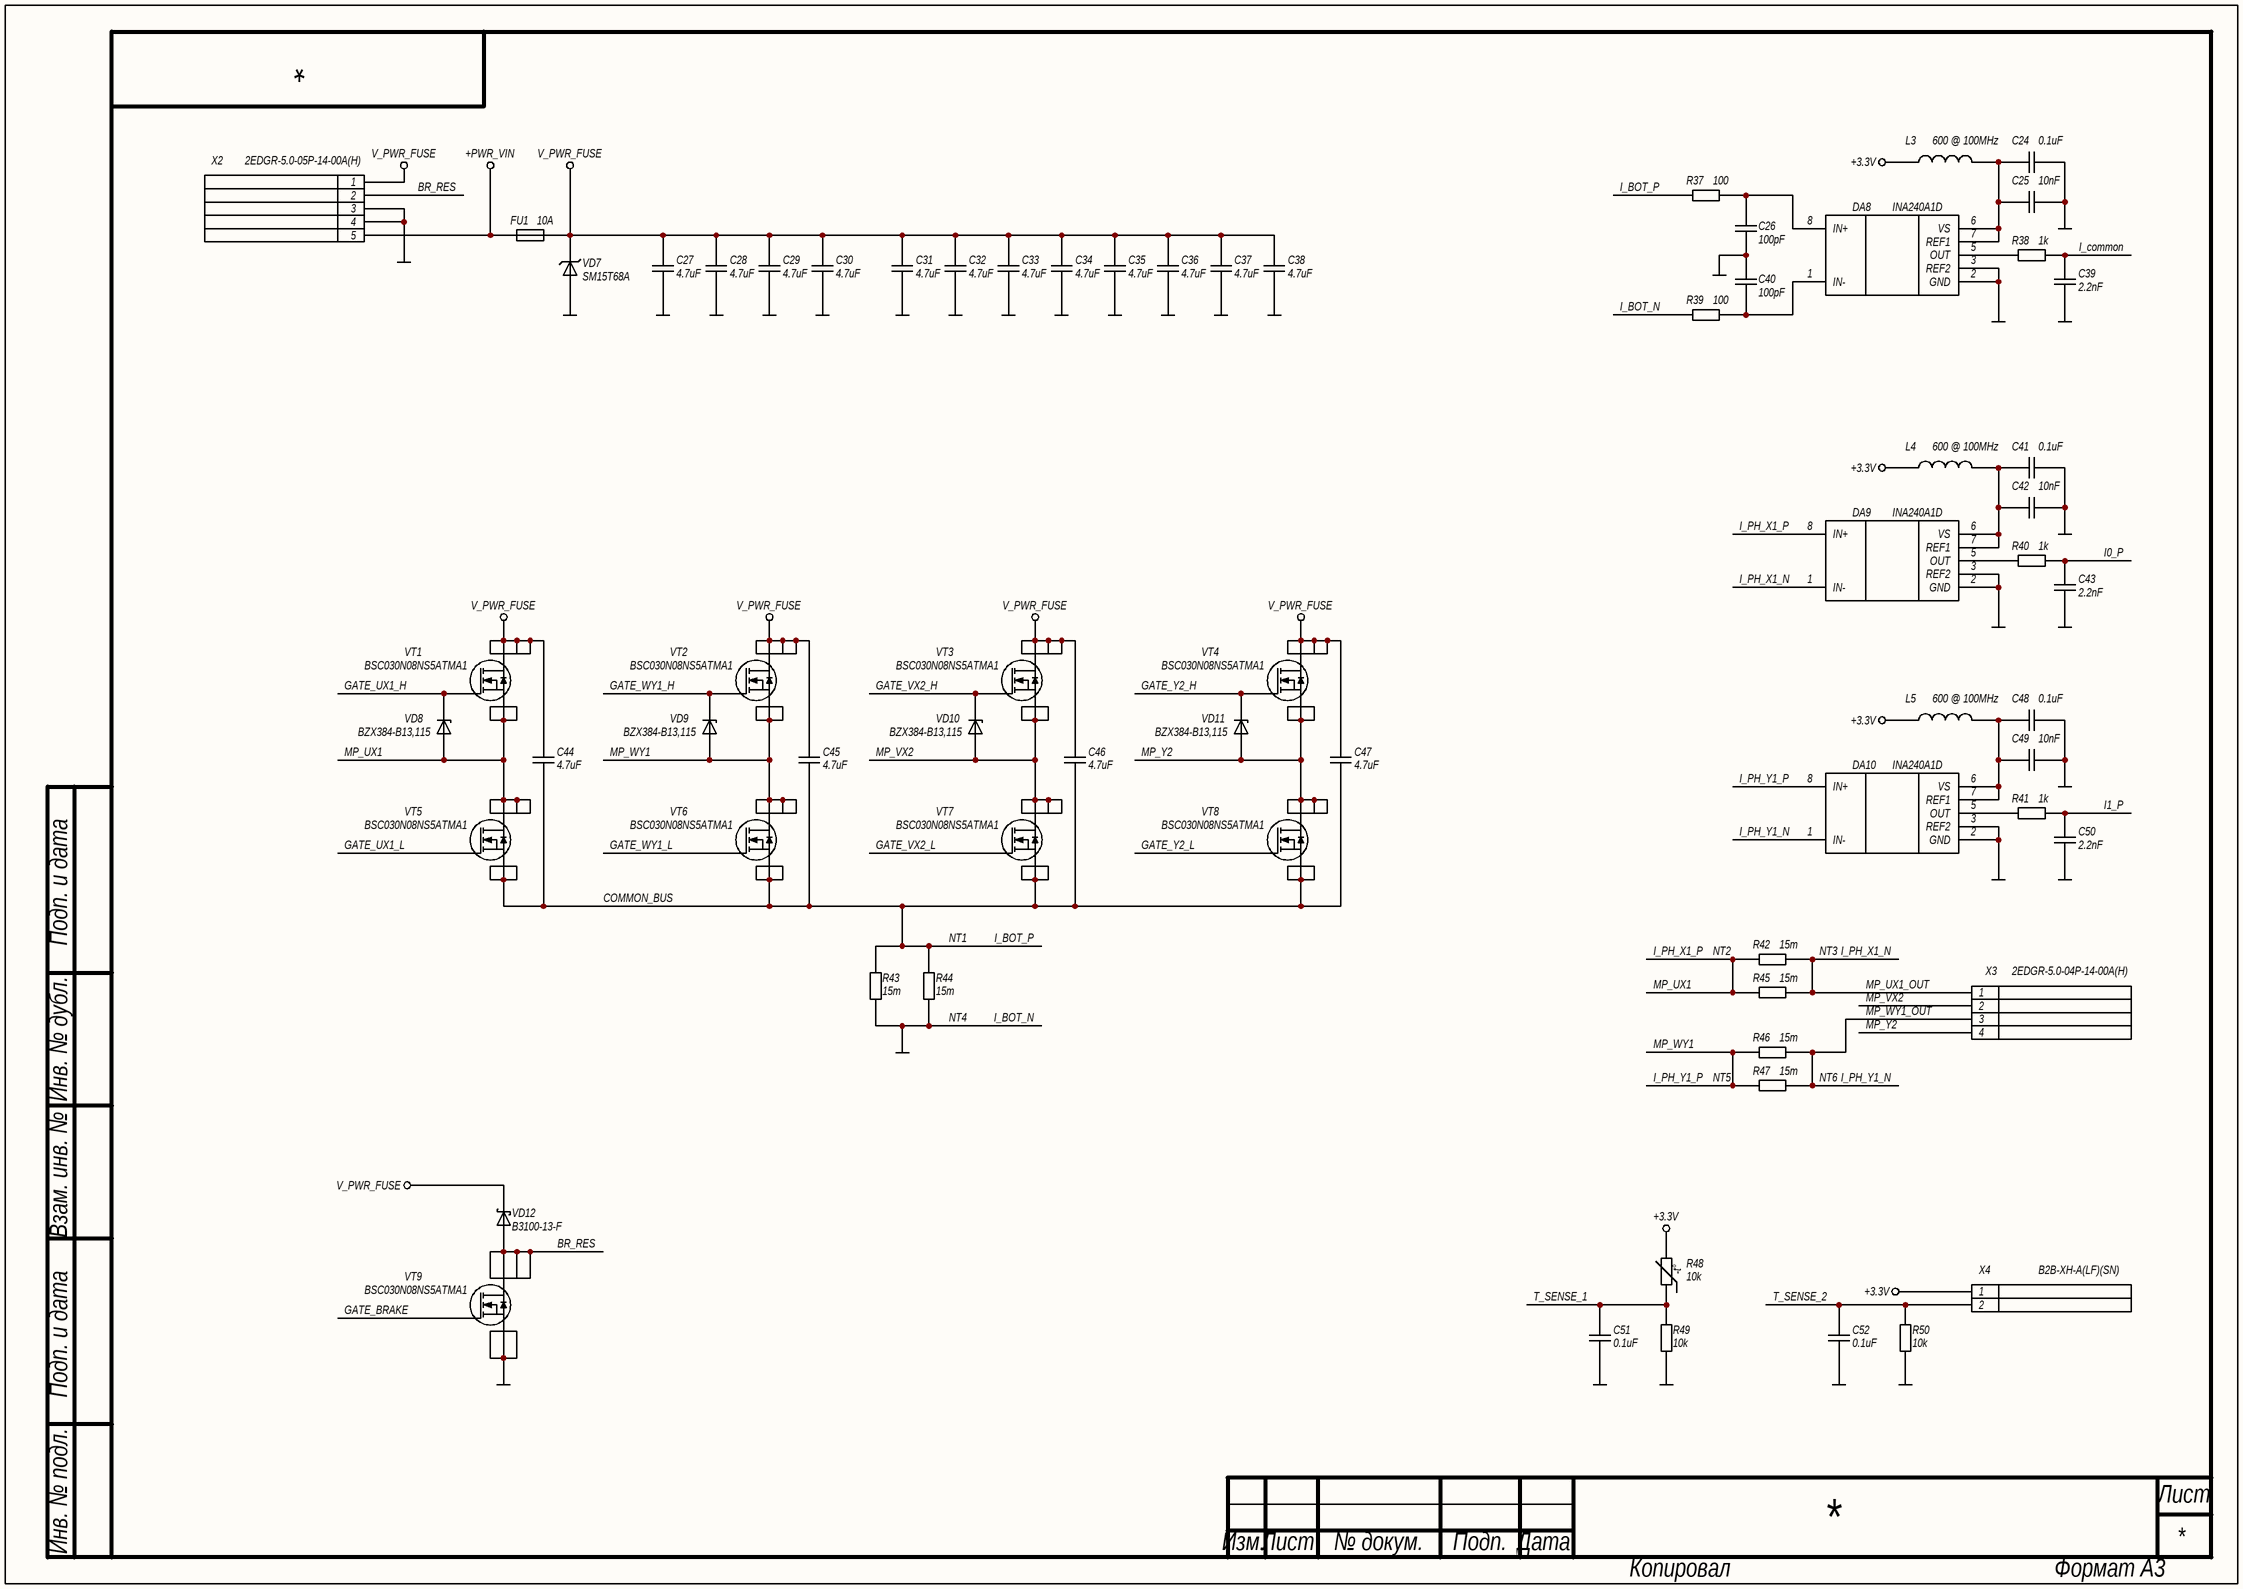
[diagram p1: MOSFETS.SchDoc]

### Parts
C24  0.1uF  [C0603N]
C25  10nF  [C0603N]
C26  100pF  [C0603N]
C27  4.7uF  [C1210N]
C28  4.7uF  [C1210N]
C29  4.7uF  [C1210N]
C30  4.7uF  [C1210N]
C31  4.7uF  [C1210N]
C32  4.7uF  [C1210N]
C33  4.7uF  [C1210N]
C34  4.7uF  [C1210N]
C35  4.7uF  [C1210N]
C36  4.7uF  [C1210N]
C37  4.7uF  [C1210N]
C38  4.7uF  [C1210N]
C39  2.2nF  [C0603N]
C40  100pF  [C0603N]
C41  0.1uF  [C0603N]
C42  10nF  [C0603N]
C43  2.2nF  [C0603N]
C44  4.7uF  [C1210N]
C45  4.7uF  [C1210N]
C46  4.7uF  [C1210N]
C47  4.7uF  [C1210N]
C48  0.1uF  [C0603N]
C49  10nF  [C0603N]
C50  2.2nF  [C0603N]
C51  0.1uF  [C0603N]
C52  0.1uF  [C0603N]
DA8  INA240A1D  [D0008A]
DA9  INA240A1D  [D0008A]
DA10  INA240A1D  [D0008A]
FU1  10A  [0154]
L3  600 @ 100MHz  [FB0603N]
L4  600 @ 100MHz  [FB0603N]
L5  600 @ 100MHz  [FB0603N]
NT1  NET_TIE  [NT_0.125_0.375]  (value not drawn)  (net tie, no BOM)
NT2  NET_TIE  [NT_0.125_0.375]  (value not drawn)  (net tie, no BOM)
NT3  NET_TIE  [NT_0.125_0.375]  (value not drawn)  (net tie, no BOM)
NT4  NET_TIE  [NT_0.125_0.375]  (value not drawn)  (net tie, no BOM)
NT5  NET_TIE  [NT_0.125_0.375]  (value not drawn)  (net tie, no BOM)
NT6  NET_TIE  [NT_0.125_0.375]  (value not drawn)  (net tie, no BOM)
R37  100  [R0603N]
R38  1k  [R0603N]
R39  100  [R0603N]
R40  1k  [R0603N]
R41  1k  [R0603N]
R42  15m  [R2512N]
R43  15m  [R2512N]
R44  15m  [R2512N]
R45  15m  [R2512N]
R46  15m  [R2512N]
R47  15m  [R2512N]
R48  10k  [RT0603N]
R49  10k  [R0603N]
R50  10k  [R0603N]
VD7  SM15T68A  [SMC]
VD8  BZX384-B13,115  [SOD323]
VD9  BZX384-B13,115  [SOD323]
VD10  BZX384-B13,115  [SOD323]
VD11  BZX384-B13,115  [SOD323]
VD12  B3100-13-F  [SMC]
VT1  BSC030N08NS5ATMA1  [PG-TDSON-8]
VT2  BSC030N08NS5ATMA1  [PG-TDSON-8]
VT3  BSC030N08NS5ATMA1  [PG-TDSON-8]
VT4  BSC030N08NS5ATMA1  [PG-TDSON-8]
VT5  BSC030N08NS5ATMA1  [PG-TDSON-8]
VT6  BSC030N08NS5ATMA1  [PG-TDSON-8]
VT7  BSC030N08NS5ATMA1  [PG-TDSON-8]
VT8  BSC030N08NS5ATMA1  [PG-TDSON-8]
VT9  BSC030N08NS5ATMA1  [PG-TDSON-8]
X2  2EDGR-5.0-05P-14-00A(H)  [2EDGR-5.0-05P-14-00A(H)]
X3  2EDGR-5.0-04P-14-00A(H)  [2EDGR-5.0-04P-14-00A(H)]
X4  B2B-XH-A(LF)(SN)  [B2B-XH-A]

### Nets
+3.3V: L3.1 L4.1 L5.1 R48.1 X4.1
+PWR_VIN: FU1.2 X2.5
GND: C24.1 C25.1 C26.2 C27.1 C28.1 C29.1 C30.1 C31.1 C32.1 C33.1 C34.1 C35.1 C36.1 C37.1 C38.1 C39.1 C40.1 C41.1 C42.1 C43.1 C48.1 C49.1 C50.1 C51.2 C52.2 DA8.2(GND) DA8.3(REF2) DA9.2(GND) DA9.3(REF2) DA10.2(GND) DA10.3(REF2) NT4.2 R43.2 R44.2 R49.2 R50.2 VD7.2(A) VT9.1(S) VT9.2(S) VT9.3(S) X2.3 X2.4
V_PWR_FUSE: C27.2 C28.2 C29.2 C30.2 C31.2 C32.2 C33.2 C34.2 C35.2 C36.2 C37.2 C38.2 C44.2 C45.2 C46.2 C47.2 FU1.1 VD7.1(K) VD12.1(K) VT1.5(D) VT1.6(D) VT1.7(D) VT1.8(D) VT2.5(D) VT2.6(D) VT2.7(D) VT2.8(D) VT3.5(D) VT3.6(D) VT3.7(D) VT3.8(D) VT4.5(D) VT4.6(D) VT4.7(D) VT4.8(D) X2.1
BR_RES: VD12.2(A) VT9.5(D) VT9.6(D) VT9.7(D) VT9.8(D) X2.2
COMMON_BUS: C44.1 C45.1 C46.1 C47.1 NT1.2 R43.1 R44.1 VT5.1(S) VT5.2(S) VT5.3(S) VT6.1(S) VT6.2(S) VT6.3(S) VT7.1(S) VT7.2(S) VT7.3(S) VT8.1(S) VT8.2(S) VT8.3(S)
GATE_BRAKE: VT9.4(G)
GATE_UX1_H: VD8.1(K) VT1.4(G)
GATE_UX1_L: VT5.4(G)
GATE_VX2_H: VD10.1(K) VT3.4(G)
GATE_VX2_L: VT7.4(G)
GATE_WY1_H: VD9.1(K) VT2.4(G)
GATE_WY1_L: VT6.4(G)
GATE_Y2_H: VD11.1(K) VT4.4(G)
GATE_Y2_L: VT8.4(G)
I0_P: C43.2 R40.1
I1_P: C50.2 R41.1
I_BOT_N: NT4.1 R39.2
I_BOT_P: NT1.1 R37.2
I_common: C39.2 R38.1
I_PH_X1_N: DA9.1(IN-) NT3.1
I_PH_X1_P: DA9.8(IN+) NT2.2
I_PH_Y1_N: DA10.1(IN-) NT6.1
I_PH_Y1_P: DA10.8(IN+) NT5.2
MP_UX1: NT2.1 R42.2 R45.2 VD8.2(A) VT1.1(S) VT1.2(S) VT1.3(S) VT5.5(D) VT5.6(D) VT5.7(D) VT5.8(D)
MP_UX1_OUT: NT3.2 R42.1 R45.1 X3.1
MP_VX2: VD10.2(A) VT3.1(S) VT3.2(S) VT3.3(S) VT7.5(D) VT7.6(D) VT7.7(D) VT7.8(D) X3.2
MP_WY1: NT5.1 R46.2 R47.2 VD9.2(A) VT2.1(S) VT2.2(S) VT2.3(S) VT6.5(D) VT6.6(D) VT6.7(D) VT6.8(D)
MP_WY1_OUT: NT6.2 R46.1 R47.1 X3.3
MP_Y2: VD11.2(A) VT4.1(S) VT4.2(S) VT4.3(S) VT8.5(D) VT8.6(D) VT8.7(D) VT8.8(D) X3.4
T_SENSE_1: C51.1 R48.2 R49.1
T_SENSE_2: C52.1 R50.1 X4.2
NetC24_2: C24.2 C25.2 DA8.6(VS) DA8.7(REF1) L3.2
NetC26_1: C26.1 DA8.8(IN+) R37.1
NetC40_2: C40.2 DA8.1(IN-) R39.1
NetC41_2: C41.2 C42.2 DA9.6(VS) DA9.7(REF1) L4.2
NetC48_2: C48.2 C49.2 DA10.6(VS) DA10.7(REF1) L5.2
NetDA8_5: DA8.5(OUT) R38.2
NetDA9_5: DA9.5(OUT) R40.2
NetDA10_5: DA10.5(OUT) R41.2

### Notes on the sheet
- Подп. и дата
- Инв. № дубл.
- Взам. инв. №
- Инв. № подл.
- Лист
- Изм.
- № докум.
- Подп.
- Дата
- Копировал
- Формат А3
- (in symbol NCP18XH103F03RB) -t°

### Library data of the parts
C24 C41 C48 C51 C52 = CL10B104KB8NNNC: as C1 on sheet DRIVERS; Артикул: CL10B104KB8NNNC; Номинал: 0.1uF; Строка для документации: https://mm.digikey.com/Volume0/opasdata/d220001/medias/docus/609/CL10B104KB8NNNC_Spec.pdf; Тип элемента: Конденсатор
C25 C42 C49 = CL10B103KB8NNNC: as C12 on sheet DRIVERS; Артикул: CL10B103KB8NNNC; Номинал: 10nF; Строка для документации: https://mm.digikey.com/Volume0/opasdata/d220001/medias/docus/609/CL10B103KB8NNNC_Spec.pdf; Тип элемента: Конденсатор
C26 C40 = CL10C101JB8NNNC: Конденсатор; Точность: 5%; Напряжение: 50V; Диэлектрик: NP0; Производитель: Samsung Electro-Mechanics; Описание: 100 pF ±5% 50V Ceramic Capacitor C0G, NP0 0603 (1608 Metric); Корпус: 0603 (1608 Metric); Температурный диапазон: -55°C ~ 125°C; Вид монтажа: SMD; Артикул: CL10C101JB8NNNC; Номинал: 100pF; Строка для документации: https://mm.digikey.com/Volume0/opasdata/d220001/medias/docus/609/CL10C101JB8NNNC_Spec.pdf; Тип элемента: Конденсатор
C27-C38 C44-C47 = CL32B475KCVZW6E: Конденсатор; Точность: 10%; Напряжение: 100V; Диэлектрик: X7R; Производитель: Samsung Electro-Mechanics; Описание: 4.7 µF ±10% 100V Ceramic Capacitor X7R 1210 (3225 Metric); Корпус: 1210 (3225 Metric); Температурный диапазон: -55°C ~ 125°C; Вид монтажа: SMD; Артикул: CL32B475KCVZW6E; Номинал: 4.7uF; Строка для документации: https://www.samsungsem.com/resources/file/global/support/product_catalog/MLCC.pdf; Тип элемента: Конденсатор
C39 C43 C50 = CL10B222KB8NNNC: Конденсатор; Точность: 10%; Напряжение: 50V; Диэлектрик: X7R; Производитель: Samsung Electro-Mechanics; Описание: 2200 pF ±10% 50V Ceramic Capacitor X7R 0603 (1608 Metric); Корпус: 0603 (1608 Metric); Температурный диапазон: -55°C ~ 125°C; Вид монтажа: SMD; Артикул: CL10B222KB8NNNC; Номинал: 2.2nF; Тип элемента: Конденсатор
DA8-DA10 = INA240A1D: Микросхема усилитель сигнала токового шунта; Производитель: Texas Instruments; Описание: Current Sense Amplifier 1 Circuit 8-SOIC; Корпус: 8-SOIC (0.154", 3.90mm Width); Температурный диапазон: -40°C ~ 125°C; Вид монтажа: SMD; Артикул: INA240A1D; Строка для документации: https://www.ti.com/lit/ds/symlink/ina240.pdf; Тип элемента: Микросхема
FU1 = 0154010.DR: Плавкий предохранитель; Тип: Fuse Holder Assembly; Производитель: Littelfuse Inc.; Описание: 10 A 125 V AC 125 V DC Fuse Board Mount (Cartridge Style Excluded) Requires Holder, Surface Mount 2-SMD, Square End Block with Holder; Корпус: 9.73mm x 5.03mm x 3.81mm; Температурный диапазон: -55°C ~ 125°C; Вид монтажа: SMD; Артикул: 0154010.DR; Ток: 10A; Строка для документации: https://www.littelfuse.com/~/media/electronics/datasheets/fuses/littelfuse_fuse_154_154t_154l_154tl_datasheet.pdf.pdf; Тип элемента: Предохранитель
L3-L5 = BLM18AG601SN1D: as L2 on sheet DRIVERS; Артикул: BLM18AG601SN1D; Номинал: 600 @ 100MHz; Строка для документации: https://www.murata.com/en-us/products/productdata/8796738650142/ENFA0003.pdf; Тип элемента: Фильтр ЭМП
NT1-NT6 = Net Tie, 0.125mm width, 0.375mm length: Соединитель цепей (Net Tie); Тип: Net Tie; Тип элемента: Другое; Артикул: Net Tie, 0.125mm width, 0.375mm length; Описание: Net Tie, 0.125mm width, 0.375mm length
R37 R39 = RC0603FR-07100RL: Резистор; Точность: 1%; ТКС: ±100ppm/°C; Напряжение: 75V; Производитель: YAGEO; Описание: 100 Ohms ±1% 0.1W, 1/10W Chip Resistor 0603 (1608 Metric) Moisture Resistant Thick Film; Корпус: 0603 (1608 Metric); Температурный диапазон: -55°C ~ 155°C; Вид монтажа: SMD; Артикул: RC0603FR-07100RL; Номинал: 100; Строка для документации: https://www.yageo.com/upload/media/product/app/datasheet/rchip/pyu-rc_group_51_rohs_l.pdf; Тип элемента: Резистор
R38 R40 R41 = RC0603FR-071KL: as R6 on sheet DRIVERS; Артикул: RC0603FR-071KL; Номинал: 1k; Строка для документации: https://www.yageo.com/upload/media/product/app/datasheet/rchip/pyu-rc_group_51_rohs_l.pdf; Тип элемента: Резистор
R42-R47 = CRA2512-FZ-R015ELF: Резистор; Точность: 1%; ТКС: ±50ppm/°C; Производитель: Bourns Inc.; Описание: 15 mOhms ±1% 3W Chip Resistor 2512 (6432 Metric) Automotive AEC-Q200, Current Sense, Moisture Resistant Metal Element; Корпус: 2512 (6432 Metric); Температурный диапазон: -55°C ~ 170°C; Вид монтажа: SMD; Артикул: CRA2512-FZ-R015ELF; Номинал: 15m; Строка для документации: https://www.bourns.com/docs/product-datasheets/cra.pdf; Тип элемента: Резистор
R48 = NCP18XH103F03RB: Резистор; Точность: 1%; Производитель: Murata Electronics; Описание: NTC Thermistor 10k 0603 (1608 Metric); Корпус: 0603 (1608 Metric); Температурный диапазон: -40°C ~ 125°C; Вид монтажа: SMD; Артикул: NCP18XH103F03RB; Номинал: 10k; Строка для документации: https://www.murata.com/en-us/api/pdfdownloadapi?cate=luNTCforTempeSenso&partno=NCP18XH103F03RB; Тип элемента: Резистор
R49 R50 = RC0603FR-0710KL: as R8 on sheet DRIVERS; Артикул: RC0603FR-0710KL; Номинал: 10k; Строка для документации: https://www.yageo.com/upload/media/product/app/datasheet/rchip/pyu-rc_group_51_rohs_l.pdf; Тип элемента: Резистор
VD7 = SM15T68A: TVS диод однонаправлвенный; Напряжение: 58.1V; Напряжение ограничения: 121V; Напряжение пробоя: 64.6V; Ток: 83A; Тип: TVS Unidirectional; Производитель: STMicroelectronics; Описание: 121V Clamp 83A (8/20µs) Ipp Tvs Diode Surface Mount SMC; Корпус: DO-214AB, SMC; Температурный диапазон: -55°C ~ 150°C (TJ); Вид монтажа: SMD; Тип элемента: Диод защитный; Артикул: SM15T68A; Строка для документации: https://www.st.com/content/ccc/resource/technical/document/datasheet/a5/63/bb/0d/f0/b8/44/65/CD00000724.pdf/files/CD00000724.pdf/jcr:content/translations/en.CD00000724.pdf
VD8-VD11 = BZX384-B13,115: Стабилитрон; Прямой ток: 5mA; Напряжение: 13V; Производитель: Nexperia USA Inc.; Описание: Zener Diode 13 V 300 mW ±2% Surface Mount SOD-323; Корпус: SOD-323; Температурный диапазон: -65°C ~ 150°C; Вид монтажа: SMD; Тип элемента: Диод; Артикул: BZX384-B13,115; Тип: Zener; Строка для документации: https://assets.nexperia.com/documents/data-sheet/BZX384_SER.pdf
VD12 = B3100-13-F: Диод Шоттки; Прямой ток: 3A; Напряжение: 100V; Производитель: Diodes Incorporated; Описание: Diode 100 V 3A Surface Mount SMC; Корпус: DO-214AB, SMC; Температурный диапазон: -55°C ~ 125°C; Вид монтажа: SMD; Артикул: B3100-13-F; Тип: Schottky; Строка для документации: https://mm.digikey.com/Volume0/opasdata/d220001/medias/docus/797/B370-B3100.pdf; Тип элемента: Диод
VT1-VT9 = BSC030N08NS5ATMA1: МОП транзистор, N-канальный; Ток: 100A (Tc); Напряжение: 80V; Сопротивление канала: 3m; Пороговое напряжение: 3V; Тип: N-MOSFET; Производитель: Infineon Technologies; Описание: N-Channel 80 V 100A (Tc) 2.5W (Ta), 139W (Tc) Surface Mount PG-TDSON-8-7; Температурный диапазон: -55°C ~ 150°C (TJ); Вид монтажа: SMD; Тип элемента: Транзистор полевой; Артикул: BSC030N08NS5ATMA1; Корпус: PG-TDSON-8; Строка для документации: https://www.infineon.com/dgdl/Infineon-BSC030N08NS5-DS-v02_02-EN.pdf?fileId=5546d4624ad04ef9014aed52f4210acf
X2 = 2EDGR-5.0-05P-14-00A(H): Разъем, 5 контактов; Тип разъема: Pluggable terminal block; Количество контактов: 5; Шаг контактов: 5mm; Ток: 20A; Напряжение: 320V; Производитель: Degson Electronics; Описание: Pluggable terminal block; 5.0mm; ways: 5; angled 90; socket; male; Температурный диапазон: -40°C ~ 105°C; Вид монтажа: Through Hole; Артикул: 2EDGR-5.0-05P-14-00A(H); Строка для документации: https://www.tme.eu/Document/aee9e19a2094185fa8ff38cbebedb2f3/2EDGR-5.0.pdf; Тип элемента: Разъем
X3 = 2EDGR-5.0-04P-14-00A(H): Разъем, 4 контакта; Тип разъема: Pluggable terminal block; Количество контактов: 4; Шаг контактов: 5mm; Ток: 20A; Напряжение: 320V; Производитель: Degson Electronics; Описание: Pluggable terminal block; 5.0mm; ways: 4; angled 90; socket; male; Температурный диапазон: -40°C ~ 105°C; Вид монтажа: Through Hole; Артикул: 2EDGR-5.0-04P-14-00A(H); Строка для документации: https://www.tme.eu/Document/aee9e19a2094185fa8ff38cbebedb2f3/2EDGR-5.0.pdf; Тип элемента: Разъем
X4 = B2B-XH-A(LF)(SN): Разъем, 2 контакта; Тип разъема: Header, Male Pin; Количество контактов: 2; Шаг контактов: 2.5mm; Ток: 3A; Напряжение: 250V; Производитель: JST Sales America Inc.; Описание: Connector Header Through Hole 2 position 0.098" (2.50mm); Температурный диапазон: -25°C ~ 85°C; Вид монтажа: Through Hole; Артикул: B2B-XH-A(LF)(SN); Строка для документации: https://www.jst-mfg.com/product/pdf/eng/eXH.pdf; Тип элемента: Разъем

## Nets that join several sheets
+3.3V: DRIVERS (5 pins), MOSFETS (5 pins)
GND: DRIVERS (67 pins), MOSFETS (42 pins)
V_PWR_FUSE: DRIVERS (HL3.2 R7.1), MOSFETS (36 pins)
GATE_BRAKE: DRIVERS (R31.1), MOSFETS (VT9.4)
GATE_UX1_H: DRIVERS (R13.1), MOSFETS (VD8.1 VT1.4)
GATE_UX1_L: DRIVERS (R15.1), MOSFETS (VT5.4)
GATE_VX2_H: DRIVERS (R23.1), MOSFETS (VD10.1 VT3.4)
GATE_VX2_L: DRIVERS (R25.1), MOSFETS (VT7.4)
GATE_WY1_H: DRIVERS (R14.1), MOSFETS (VD9.1 VT2.4)
GATE_WY1_L: DRIVERS (R16.1), MOSFETS (VT6.4)
GATE_Y2_H: DRIVERS (R24.1), MOSFETS (VD11.1 VT4.4)
GATE_Y2_L: DRIVERS (R26.1), MOSFETS (VT8.4)
I0_P: DRIVERS (X1.24 X5.24), MOSFETS (C43.2 R40.1)
I1_P: DRIVERS (X1.26 X5.26), MOSFETS (C50.2 R41.1)
I_common: DRIVERS (X1.22 X5.22), MOSFETS (C39.2 R38.1)
MP_UX1: DRIVERS (C17.2 DA3.6), MOSFETS (11 pins)
MP_VX2: DRIVERS (C21.2 DA5.6), MOSFETS (9 pins)
MP_WY1: DRIVERS (C18.2 DA4.6), MOSFETS (11 pins)
MP_Y2: DRIVERS (C22.2 DA6.6), MOSFETS (9 pins)
T_SENSE_1: DRIVERS (X1.29 X5.29), MOSFETS (C51.1 R48.2 R49.1)
T_SENSE_2: DRIVERS (X1.30 X5.30), MOSFETS (C52.1 R50.1 X4.2)

## Assembly variants
Top Connector: not fitted X5
Bottom Connector: not fitted X1